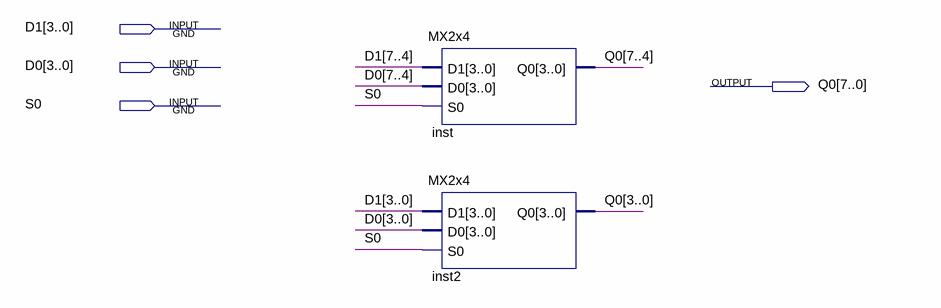
[diagram p0: schematic sheet]
// Quartus schematic MX2x8.bdf as structural Verilog: 2 symbols, 4 pins
module MX2x8 (
  input  [7:0] D1,
  input  [7:0] D0,
  input  S0,
  output [7:0] Q0
);

  MX2x4 inst (.D1(D1[7:4]), .D0(D0[7:4]), .S0(S0), .Q0(Q0[7:4]));
  MX2x4 inst2 (.D1(D1[3:0]), .D0(D0[3:0]), .S0(S0), .Q0(Q0[3:0]));
endmodule
